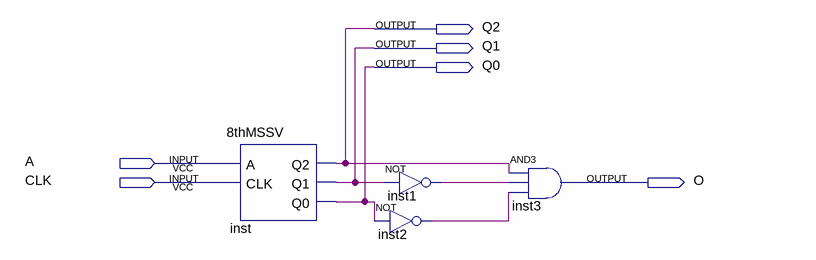
[diagram p0: schematic sheet]
// Quartus schematic Moore.bdf as structural Verilog: 4 symbols, 6 pins
module Moore (
  input  A,
  input  CLK,
  output Q2,
  output Q1,
  output Q0,
  output O
);

  wire inst1_out, inst2_out;

  \8thMSSV  inst (.A(A), .CLK(CLK), .Q2(Q2), .Q1(Q1), .Q0(Q0));
  not inst1 (inst1_out, Q1);
  not inst2 (inst2_out, Q0);
  and inst3 (O, Q2, inst1_out, inst2_out);
endmodule
